# Altium schematic sheet EDTENS.SchDoc
size A0
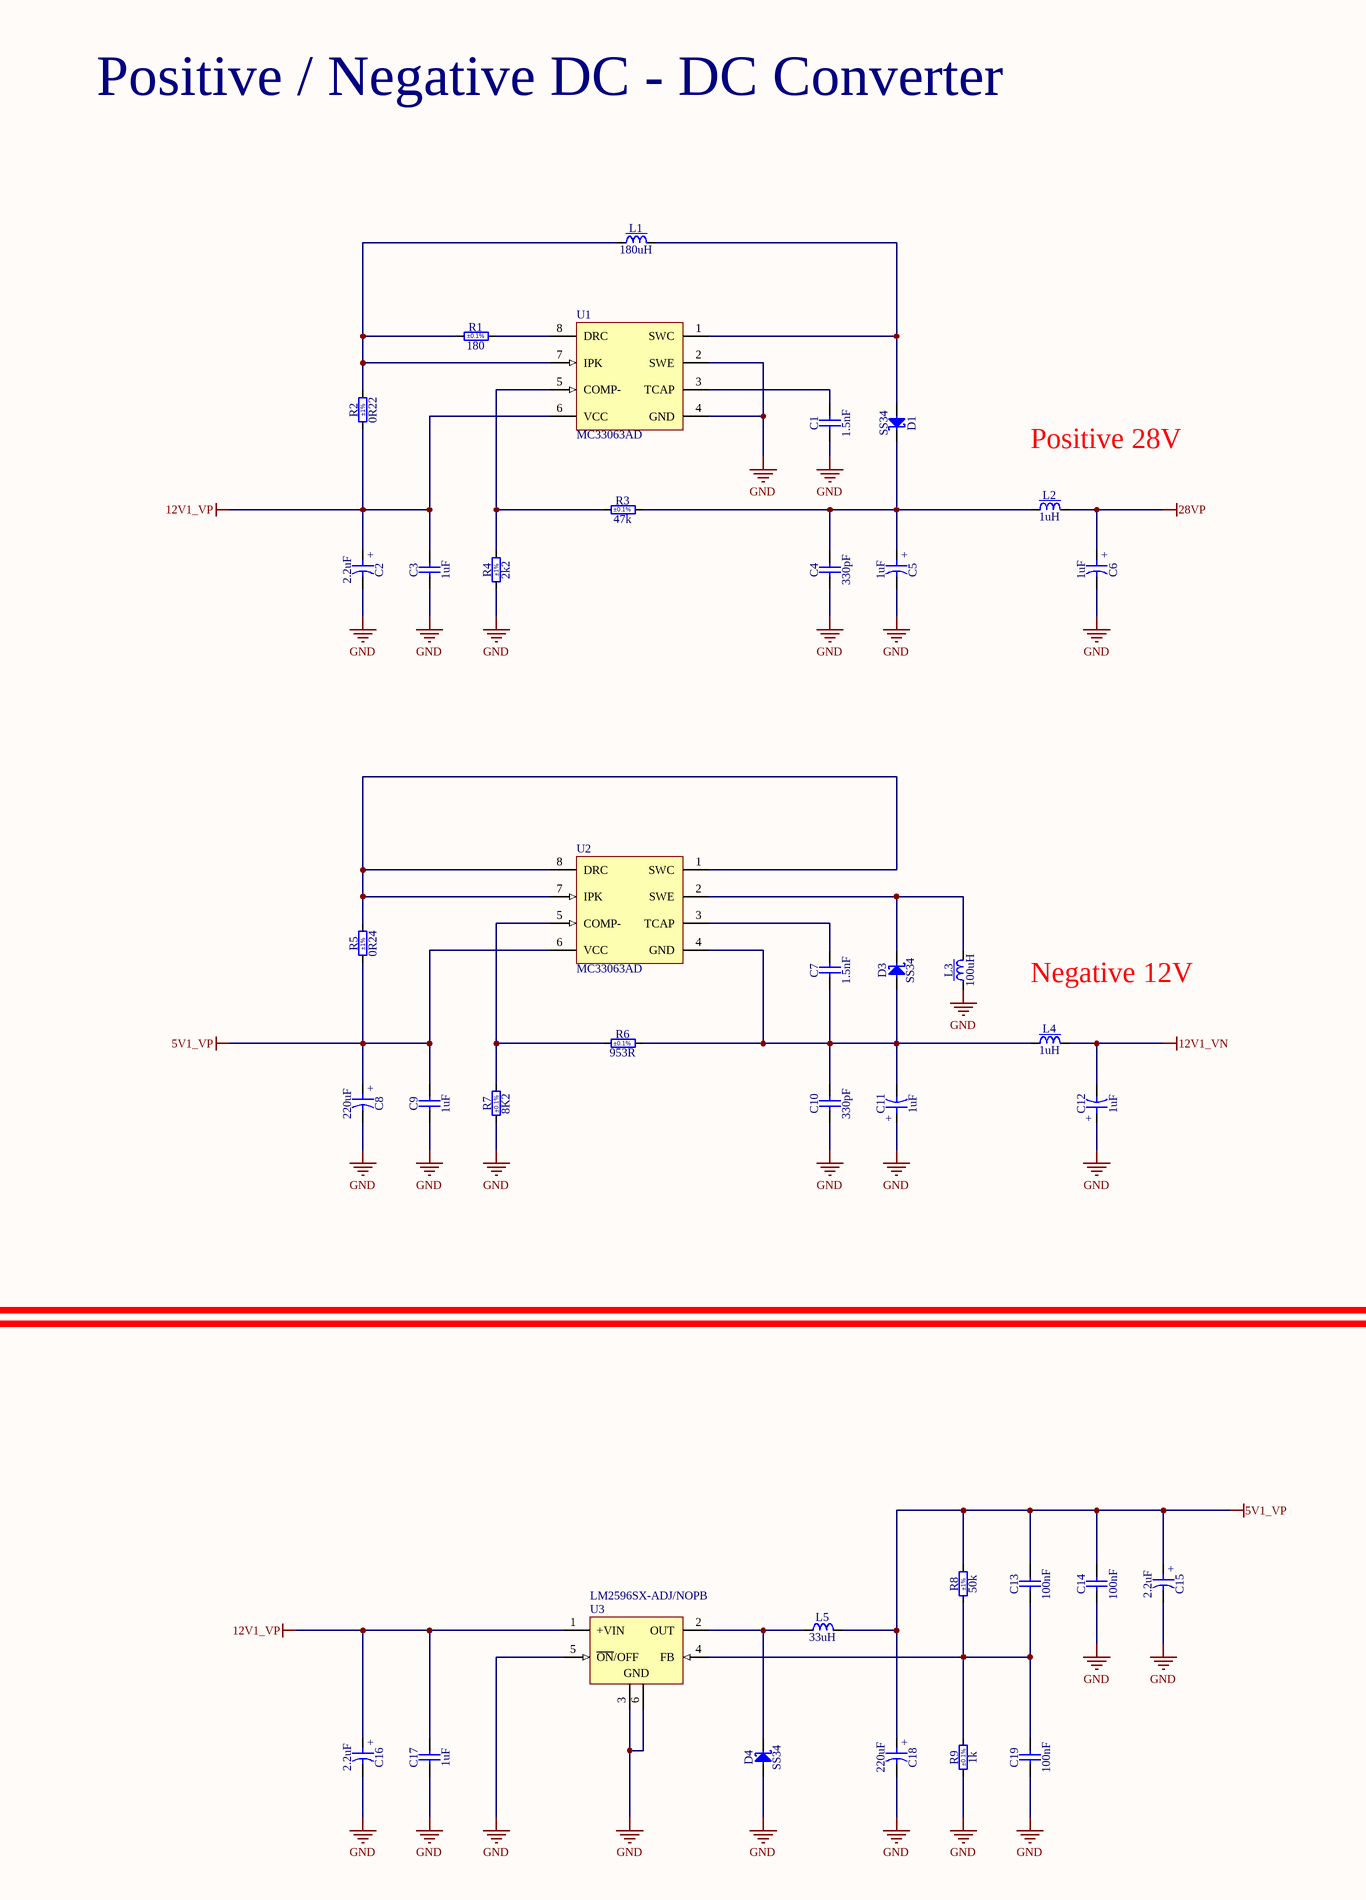
[diagram p0: EDTENS.SchDoc, left]
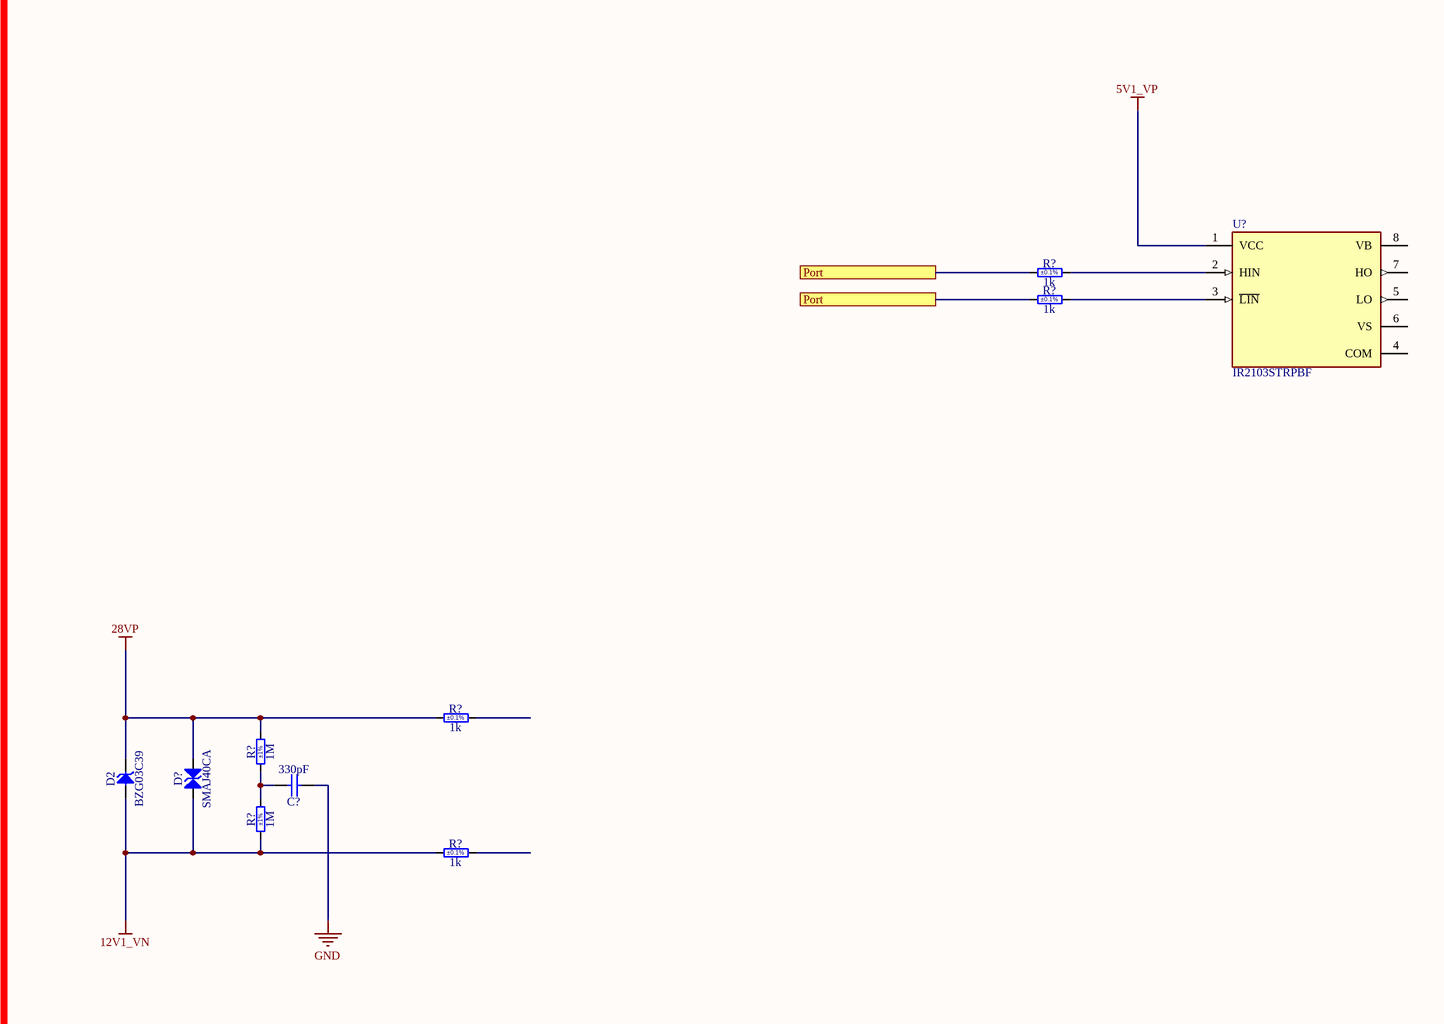
[diagram p1: EDTENS.SchDoc, right]

## Parts
(Parts that share a designator on the sheet are numbered #1, #2 ... from top to bottom, then left to right.)
C1  1.5nF  [CAPC3216X140N]
C2  2.2uF  [CAPMP3216X180N]
C3  1uF  [CAPC3216X140N]
C4  330pF  [CAPC3216X140N]
C5  1uF  [CAPMP6032X280N]
C6  1uF  [CAPMP3216X180N]
C7  1.5nF  [CAPC3216X140N]
C8  220uF  [CAPMP7343X430N]
C9  1uF  [CAPC3216X140N]
C10  330pF  [CAPC3216X140N]
C11  1uF  [CAPMP6032X280N]
C12  1uF  [CAPMP3216X180N]
C13  100nF  [CAPC3216X180N]
C14  100nF  [CAPC3216X180N]
C15  2.2uF  [CAPMP3216X180N]
C16  2.2uF  [CAPMP3216X180N]
C17  1uF  [CAPC3216X140N]
C18  220uF  [CAPMP7362X380N]
C19  100nF  [CAPC3216X180N]
C?  330pF  [CAPC3216X140N]
D1  SS34  [DIOM7959X265N]
D2  BZG03C39  [DIOM5326X230N]
D3  SS34  [DIOM7959X265N]
D4  SS34  [DIOM7959X265N]
D?  SMAJ40CA  [DIOM5226X262N]
L1  180uH  [IND_WURTH_WE-PD_XXL]
L2  1uH  [INDM3225X210N]
L3  100uH  [IND_WURTH_WE-PD_XXL]
L4  1uH  [INDM3225X210N]
L5  33uH  [IND_BOURNS_PM127SH]
R1  180  Tolerance: ±0.1%  [RESC3216X65N]
R2  0R22  Tolerance: ±1%  [RESC6532X80N]
R3  47k  Tolerance: ±0.1%  [RESC3216X65N]
R4  2k2  Tolerance: ±1%  [RESC3216X65N]
R5  0R24  Tolerance: ±1%  [RESC6532X80N]
R6  953R  Tolerance: ±0.1%  [RESC3216X65N]
R7  8K2  Tolerance: ±0.1%  [RESC3216X65N]
R8  50k  Tolerance: ±1%  [RES_SEI_HVC1206]
R9  1k  Tolerance: ±0.1%  [RESC3216X65N]
R?#1  1k  Tolerance: ±0.1%  [RESC3216X65N]
R?#2  1k  Tolerance: ±0.1%  [RESC3216X65N]
R?#3  1k  Tolerance: ±0.1%  [RESC3216X65N]
R?#4  1M  Tolerance: ±1%  [RESC6331X70N]
R?#5  1M  Tolerance: ±1%  [RESC6331X70N]
R?#6  1k  Tolerance: ±0.1%  [RESC3216X65N]
U1  MC33063AD  [D0008A_N]
U2  MC33063AD  [D0008A_N]
U3  LM2596SX-ADJ/NOPB  [KTT0005B_L]
U?  IR2103STRPBF  [FP-PG-DSO-8-MFG]

## Blocks framed on the sheet
Positive / Negative DC - DC Converter: C1-C12 D1 D3 L1-L4 R1-R7 U1 U2

## Ports
Port

## Nets
5V1_VP: C8.1 C9.2 C13.2 C14.2 C15.1 C18.1 L5.2 R5.1 R8.2 U2.6(VCC) U?.1(VCC)
12V1_VN: C12.2 D2.2(A) D?.1 L4.2 R?#5.1 R?#6.1
12V1_VP: C2.1 C3.2 C16.1 C17.2 R2.1 U1.6(VCC) U3.1(+VIN)
28VP: C6.1 D2.1(C) D?.2 L2.2 R?#3.1 R?#4.2
GND: C1.1 C2.2 C3.1 C4.1 C5.2 C6.2 C8.2 C9.1 C10.1 C11.1 C12.1 C14.1 C15.2 C16.2 C17.1 C18.2 C19.1 C?.1 D4.2(A) L3.1 R4.1 R7.1 R9.1 U1.2(SWE) U1.4(GND) U3.3(GND) U3.5(~{ON}/OFF) U3.6(GND)
Port: R?#1.1 R?#2.1 ; port Port
NetC1_2: C1.2 U1.3(TCAP)
NetC4_2: C4.2 C5.1 D1.1(C) L2.1 R3.2
NetC7_1: C7.1 C10.2 C11.2 D3.2(A) L4.1 R6.2 U2.4(GND)
NetC7_2: C7.2 U2.3(TCAP)
NetC13_1: C13.1 C19.2 R8.1 R9.2 U3.4(FB)
NetC?_2: C?.2 R?#4.1 R?#5.2
NetD1_2: D1.2(A) L1.2 U1.1(SWC)
NetD3_1: D3.1(C) L3.2 U2.2(SWE)
NetD4_1: D4.1(C) L5.1 U3.2(OUT)
NetL1_1: L1.1 R1.1 R2.2 U1.7(IPK)
NetR1_2: R1.2 U1.8(DRC)
NetR3_1: R3.1 R4.2 U1.5(COMP-)
NetR5_2: R5.2 U2.1(SWC) U2.7(IPK) U2.8(DRC)
NetR6_1: R6.1 R7.2 U2.5(COMP-)
NetR?#1_2: R?#1.2 U?.2(HIN)
NetR?#2_2: R?#2.2 U?.3(~{LIN})

Not connected (* = marked no-connect by the designer): R?#3 2; R?#6 2; U? 4(COM) 5(LO) 6(VS) 7(HO) 8(VB)

## Notes on the sheet
- Positive 28V
- Negative 12V
- (in symbol CTE3216-18_1UF_35V_10%) +
- (in symbol CTE3216-18_2.2UF_25V_10%) +
- (in symbol CTE6032-28_1UF_50V_10%) +
- (in symbol CTE7343-43_220UF_16V_10%) +
- (in symbol CTE7362-38_220UF_16V_10%_LESR0075) +

## Library data of the parts
C1 C7 = CC1206_1.5NF_50V_5%_NP0: Non-polarised capacitor; Part Description: SMD Multilayer Chip Ceramic Capacitor; Manufacturer: GENERIC; Manufacturer1 Part Number: 2238 863 15152; Voltage: 50V; TC: C0G/NP0; Tolerance: ±5%; Part Number: CC1206_1.5NF_50V_5%_NP0; Component Kind: Standard; Component Type: Standard; Pin Count: 2; Value: 1.5nF; Status: Preferred; Manufacturer Part Number: CC1206_1.5NF_50V_5%_NP0; Case: 1206; Mounted: Yes; Socket: No; SMD: Yes; Sense: No; Manufacturer1 Example: PHYCOMP; Manufacturer1 ComponentHeight: 1.25mm; HelpURL: \\cern.ch\dfs\Applications\Altium\Datasheets\CC1206_NP0_PHYCOMP.pdf; Author: CERN DEM JLC; CreateDate: 12/3/2007; LatestRevisionDate: 12/3/2007
C2 C15 C16 = CTE3216-18_2.2UF_25V_10%: Polarised capacitor; Part Description: Solid Tantalum Chip Capacitor; Manufacturer: GENERIC; Manufacturer1 Part Number: TAJA225K025R; Voltage: 25V; Tolerance: ±10%; Part Number: CTE3216-18_2.2UF_25V_10%; Component Kind: Standard; Component Type: Standard; Pin Count: 2; Value: 2.2uF; Status: Preferred; Manufacturer Part Number: CTE3216-18_2.2UF_25V_10%; Case: A; Mounted: Yes; Socket: No; SMD: Yes; Sense: No; Manufacturer1 Example: AVX; Manufacturer1 ComponentHeight: 1.8mm; HelpURL: \\cern.ch\dfs\Applications\Altium\Datasheets\CTE_AVX_TAJ.pdf; Author: CERN DEM JLC; CreateDate: 5/26/2008; LatestRevisionDate: 5/26/2008
C3 C9 C17 = CC1206_1UF_100V_10%_X7R: Non-polarised capacitor; Part Description: SMD Multilayer Chip Ceramic Capacitor; Manufacturer: GENERIC; Manufacturer1 Part Number: C1206C105K1RAC; Voltage: 100V; TC: X7R; Tolerance: ±10%; Part Number: CC1206_1UF_100V_10%_X7R; Component Kind: Standard; Component Type: Standard; Pin Count: 2; Value: 1uF; Status: Preferred; Manufacturer Part Number: CC1206_1UF_100V_10%_X7R; Case: 1206; Mounted: Yes; Socket: No; SMD: Yes; Sense: No; Manufacturer1 Example: KEMET; Manufacturer1 ComponentHeight: 1.8mm; HelpURL: \\cern.ch\dfs\Applications\Altium\Datasheets\CC1206_X7R_KEMET_OPENMODE.pdf; Author: CERN DEM BC; CreateDate: 1/24/2020; LatestRevisionDate: 1/24/2020
C4 C10 C? = CC1206_330PF_100V_10%_NP0: Non-polarised capacitor; Part Description: SMD Multilayer Chip Ceramic Capacitor; Manufacturer: GENERIC; Manufacturer1 Part Number: 12061A331KAT2A; Voltage: 100V; TC: C0G/NP0; Tolerance: ±10%; Part Number: CC1206_330PF_100V_10%_NP0; Component Kind: Standard; Component Type: Standard; Pin Count: 2; Value: 330pF; Status: Preferred; Manufacturer Part Number: CC1206_330PF_100V_10%_NP0; Case: 1206; Mounted: Yes; Socket: No; SMD: Yes; Sense: No; Manufacturer1 Example: AVX; Manufacturer1 ComponentHeight: 0.94mm; HelpURL: \\cern.ch\dfs\Applications\Altium\Datasheets\CC1206_NP0_AVX.pdf; Author: CERN DEM JLC; CreateDate: 8/24/2009; LatestRevisionDate: 8/24/2009
C5 C11 = CTE6032-28_1UF_50V_10%: Polarised capacitor; Part Description: Solid Tantalum Chip Capacitor; Manufacturer: GENERIC; Manufacturer1 Part Number: TAJC105K050R; Voltage: 50V; Tolerance: ±10%; Part Number: CTE6032-28_1UF_50V_10%; Component Kind: Standard; Component Type: Standard; Pin Count: 2; Value: 1uF; Status: Preferred; Manufacturer Part Number: CTE6032-28_1UF_50V_10%; Case: C; Mounted: Yes; Socket: No; SMD: Yes; Sense: No; Manufacturer1 Example: AVX; Manufacturer1 ComponentHeight: 2.8mm; HelpURL: \\cern.ch\dfs\Applications\Altium\Datasheets\CTE_AVX_TAJ.pdf; Author: CERN DEM JLC; CreateDate: 12/3/2007; LatestRevisionDate: 12/3/2007
C6 C12 = CTE3216-18_1UF_35V_10%: Polarised capacitor; Part Description: Solid Tantalum Chip Capacitor; Manufacturer: GENERIC; Manufacturer1 Part Number: TAJA105K035R; Voltage: 35V; Tolerance: ±10%; Part Number: CTE3216-18_1UF_35V_10%; Component Kind: Standard; Component Type: Standard; Pin Count: 2; Value: 1uF; Status: Preferred; Manufacturer Part Number: CTE3216-18_1UF_35V_10%; Case: A; Mounted: Yes; Socket: No; SMD: Yes; Sense: No; Manufacturer1 Example: AVX; Manufacturer1 ComponentHeight: 1.8mm; HelpURL: \\cern.ch\dfs\Applications\Altium\Datasheets\CTE_AVX_TAJ.pdf; Author: CERN DEM JLC; CreateDate: 12/3/2007; LatestRevisionDate: 12/3/2007
C8 = CTE7343-43_220UF_16V_10%: Polarised capacitor; Part Description: Solid Tantalum Chip Capacitor; Manufacturer: GENERIC; Manufacturer1 Part Number: TAJE227K016R; Voltage: 16V; Tolerance: ±10%; Part Number: CTE7343-43_220UF_16V_10%; Component Kind: Standard; Component Type: Standard; Pin Count: 2; Value: 220uF; Status: Preferred; Manufacturer Part Number: CTE7343-43_220UF_16V_10%; Case: E; Mounted: Yes; Socket: No; SMD: Yes; Sense: No; Manufacturer1 Example: AVX; Manufacturer1 ComponentHeight: 4.3mm; HelpURL: \\cern.ch\dfs\Applications\Altium\Datasheets\CTE_AVX_TAJ.pdf; Author: CERN DEM JLC; CreateDate: 12/3/2007; LatestRevisionDate: 12/3/2007
C13 C14 C19 = CC1206_100NF_50V_5%_C0G_TDK_CGA5L2C0G1H104J160AA: Non-polarised capacitor; Part Description: SMD Multilayer Chip Ceramic Capacitor (Automotive Grade); Manufacturer: TDK; Voltage: 50V; TC: C0G/NP0; Tolerance: ±5%; Part Number: CC1206_100NF_50V_5%_C0G_TDK_CGA5L2C0G1H104J160AA; Component Kind: Standard; Component Type: Standard; Pin Count: 2; Value: 100nF; Status: Not Recommended; Manufacturer Part Number: CGA5L2C0G1H104J160AA; Case: 1206; Mounted: Yes; Socket: No; SMD: Yes; Sense: No; ComponentHeight: 1.8mm; HelpURL: \\cern.ch\dfs\Applications\Altium\Datasheets\CC1206_C0G_TDK_CGA(up to 50V).pdf; Author: CERN DEM BC; CreateDate: 4/18/2016; LatestRevisionDate: 1/24/2018
C18 = CTE7362-38_220UF_16V_10%_LESR0075: Polarised capacitor; Part Description: Low ESR 0R075 Solid Tantalum Chip Capacitor; Manufacturer: GENERIC; Manufacturer1 Part Number: TPSV227K016R0075; Voltage: 16V; Tolerance: ±10%; Part Number: CTE7362-38_220UF_16V_10%_LESR0075; Component Kind: Standard; Component Type: Standard; Pin Count: 2; Value: 220uF; Status: Preferred; Manufacturer Part Number: CTE7362-38_220UF_16V_10%_LESR0075; Case: V; Mounted: Yes; Socket: No; SMD: Yes; Sense: No; Manufacturer1 Example: AVX; Manufacturer1 ComponentHeight: 3.8mm; HelpURL: \\cern.ch\dfs\Applications\Altium\Datasheets\CTE-LESR_AVX_TPS.pdf; Author: CERN DEM JLC; CreateDate: 5/5/2008; LatestRevisionDate: 7/6/2009
D1 D3 D4 = SS34: Schottky Diode; Part Description: Surface Mount Schottky Barrier Rectifier; Manufacturer: FAIRCHILD SEMICONDUCTOR; Voltage: 40V; Power: 3A; PressFit: No; Bonding: No; Part Number: SS34; Component Kind: Standard; Component Type: Standard; Device: SS34; PackageDescription: DO-214-AB/SMC Molded Diode, Body 7.95x5.9mm, IPC Medium Density; Manufacturer Part Number: SS34; Pin Count: 2; Case: DO-214AB; Mounted: Yes; Socket: No; SMD: Yes; Sense: No; ComponentHeight: 2.65mm; HelpURL: \\cern.ch\dfs\Applications\Altium\Datasheets\SS34.pdf; Author: CERN DEM JLC; CreateDate: 8/23/2010; LatestRevisionDate: 11/8/2017
D2 = BZG03C39: Zener Diode; Part Description: Voltage Regulator Diode; Manufacturer: VISHAY SEMICONDUCTORS; Voltage: 39V; Power: 1.25W; PressFit: No; Bonding: No; Part Number: BZG03C39; Component Kind: Standard; Component Type: Standard; Device: BZG03C39; PackageDescription: DO-214-AC/SMA Molded Diode, Body 5.3x2.6mm, IPC Medium Density; Manufacturer Part Number: BZG03C39; Pin Count: 2; Case: DO-214AC; Mounted: Yes; Socket: No; SMD: Yes; Sense: No; ComponentHeight: 2.3mm; HelpURL: \\cern.ch\dfs\Applications\Altium\Datasheets\BZG03C.pdf; Author: CERN DEM JLC; CreateDate: 6/2/2008; LatestRevisionDate: 6/2/2008
D? = SMAJ40CA: Transient Voltage Suppressor Diode (Bi-Directional); Part Description: Surface Mount Bi-directional Transient Voltage Suppressor Diode; Manufacturer: BOURNS; Voltage: 40V; Power: 400W; PressFit: No; Bonding: No; Part Number: SMAJ40CA; Component Kind: Standard; Component Type: Standard; Device: SMAJ40CA; PackageDescription: DO-214-AC/SMA Diode, Molded Body; 5.21mm L X 2.605mm W X 2.62mm H, IPC Medium Density; Manufacturer Part Number: SMAJ40CA; Pin Count: 2; Case: DO-214AC; Mounted: Yes; Socket: No; SMD: Yes; Sense: No; ComponentHeight: 2.62mm; HelpURL: \\cern.ch\dfs\Applications\Altium\Datasheets\SMAJ40CA.pdf; Author: CERN DEM JLC; CreateDate: 7/11/2018; LatestRevisionDate: 7/11/2018
L1 = IND_100UH_20%_WURTH_WE-PD_7447709101: Inductor With Core; Part Number: IND_180UH_20%_WURTH_WE-PD_7447709101; Part Description: Power-Choke Inductor (WE-PD Series); Manufacturer: WURTH ELEKTRONIK; Power: 2.5A; Resistance: 0.1R; Tolerance: ±20%; Component Kind: Standard; Component Type: Standard; Pin Count: 2; Value: 180uH; Manufacturer Part Number: 7447709101; Mounted: Yes; Socket: No; SMD: Yes; Sense: No; ComponentHeight: 10mm; HelpURL: \\cern.ch\dfs\Applications\Altium\Datasheets\IND_WURTH_WE-PD_7447709101.pdf; Author: Mehdi Amiri; CreateDate: 3/15/2012; LatestRevisionDate: 11/04/2023
L2 L4 = IND1210_1UH_10%_EPCOS_B82422A: Inductor With Core; Part Description: SMT Inductor SIMID Series; Manufacturer: EPCOS; Manufacturer Part Number: B82422A1102K100; Power: 380mA; Resistance: 0.34R; Tolerance: ±10%; Part Number: IND1210_1UH_10%_EPCOS_B82422A; Component Kind: Standard; Component Type: Standard; Pin Count: 2; Value: 1uH; Case: 1210; Mounted: Yes; Socket: No; SMD: Yes; Sense: No; ComponentHeight: 2.1mm; HelpURL: \\cern.ch\dfs\Applications\Altium\Datasheets\IND1210_EPCOS_B82422A.pdf; Author: CERN DEM JLC; CreateDate: 11/30/2011; LatestRevisionDate: 11/30/2011
L3 = IND_100UH_20%_WURTH_WE-PD_7447709101: Inductor With Core; Part Description: Power-Choke Inductor (WE-PD Series); Manufacturer: WURTH ELEKTRONIK; Power: 2.5A; Resistance: 0.1R; Tolerance: ±20%; Part Number: IND_100UH_20%_WURTH_WE-PD_7447709101; Component Kind: Standard; Component Type: Standard; Pin Count: 2; Value: 100uH; Manufacturer Part Number: 7447709101; Mounted: Yes; Socket: No; SMD: Yes; Sense: No; ComponentHeight: 10mm; HelpURL: \\cern.ch\dfs\Applications\Altium\Datasheets\IND_WURTH_WE-PD_7447709101.pdf; Author: CERN DEM JLC; CreateDate: 3/15/2012; LatestRevisionDate: 3/15/2012
L5 = IND_33UH_20%_BOURNS_PM127SH: Inductor; Part Description: Shielded SMD Power Inductor PM127SH Series; Manufacturer: BOURNS; Manufacturer Part Number: PM127SH-330M-RC; Power: 3.5A; Resistance: 0.057R; Tolerance: ±20%; Part Number: IND_33UH_20%_BOURNS_PM127SH; Component Kind: Standard; Component Type: Standard; Pin Count: 2; Value: 33uH; Mounted: Yes; Socket: No; SMD: Yes; Sense: No; ComponentHeight: 8mm; HelpURL: \\cern.ch\dfs\Applications\Altium\Datasheets\IND_BOURNS_PM127SH.pdf; Author: CERN DEM JLC; CreateDate: 11/18/2009; LatestRevisionDate: 11/18/2009
R1 = R1206_180R_0.1%_0.25W_25PPM: Resistor - 0.1%; Part Description: Thin Film Chip Resistor; Manufacturer: GENERIC; Manufacturer1 Part Number: RN73H2BTTD1800B25; Power: 0.25W; TC: ±25ppm/°C; PressFit: No; Part Number: R1206_180R_0.1%_0.25W_25PPM; Component Kind: Standard; Component Type: Standard; Pin Count: 2; Value: 180; Status: Not Recommended; Manufacturer Part Number: R1206_180R_0.1%_0.25W_25PPM; Case: 1206; Mounted: Yes; Sense: No; Socket: No; SMD: Yes; Manufacturer1 Example: KOA; Manufacturer1 ComponentHeight: 0.70mm; HelpURL: \\cern.ch\dfs\Applications\Altium\Datasheets\R1206_KOA_RN73H.pdf; Author: CERN DEM JLC; CreateDate: 12/3/2007; LatestRevisionDate: 3/13/2008
R2 = R2512_0R5_1%_1.5W_100PPM: Resistor - 1%; Part Number: R2512_0R22_1%_1.5W_100PPM; Part Description: Thick Film Chip Resistor; Manufacturer: GENERIC; Manufacturer1 Part Number: LR2512-R22FW; Power: 1.5W; TC: ±100ppm/°C; PressFit: No; Component Kind: Standard; Component Type: Standard; Pin Count: 2; Value: 0R22; Status: None; Manufacturer Part Number: R2512_0R22_1%_1.5W_100PPM; Case: 2512; Mounted: Yes; Sense: No; Socket: No; SMD: Yes; Manufacturer1 Example: WELWYN; Manufacturer1 ComponentHeight: 0.8mm; HelpURL: \\cern.ch\dfs\Applications\Altium\Datasheets\R2512_WELWYN_LR.pdf; Author: Mehdi Amiri; CreateDate: 8/23/2010; LatestRevisionDate: 8/23/2010
R3 = R1206_47K_0.1%_0.25W_25PPM: Resistor - 0.1%; Part Description: Thin Film Chip Resistor; Manufacturer: GENERIC; Manufacturer1 Part Number: RN73H2BTTD4702B25; Power: 0.25W; TC: ±25ppm/°C; PressFit: No; Part Number: R1206_47K_0.1%_0.25W_25PPM; Component Kind: Standard; Component Type: Standard; Pin Count: 2; Value: 47k; Status: Not Recommended; Manufacturer Part Number: R1206_47K_0.1%_0.25W_25PPM; Case: 1206; Mounted: Yes; Sense: No; Socket: No; SMD: Yes; Manufacturer1 Example: KOA; Manufacturer1 ComponentHeight: 0.70mm; HelpURL: \\cern.ch\dfs\Applications\Altium\Datasheets\R1206_KOA_RN73H.pdf; Author: CERN DEM JLC; CreateDate: 12/3/2007; LatestRevisionDate: 3/13/2008
R4 = R1206_2K2_1%_0.25W_100PPM: Resistor - 1%; Part Description: General Purpose Thick Film Chip Resistor; Manufacturer: GENERIC; Manufacturer1 Part Number: NRC12F2201TRF; Power: 0.25W; TC: ±100ppm/°C; PressFit: No; Part Number: R1206_2K2_1%_0.25W_100PPM; Component Kind: Standard; Component Type: Standard; Pin Count: 2; Value: 2k2; Status: Preferred; Manufacturer Part Number: R1206_2K2_1%_0.25W_100PPM; Case: 1206; Mounted: Yes; Sense: No; Socket: No; SMD: Yes; Manufacturer1 Example: NIC COMPONENT; Manufacturer1 ComponentHeight: 0.65mm; HelpURL: \\cern.ch\dfs\Applications\Altium\Datasheets\R1206_NIC_NRC.pdf; Author: CERN DEM JLC; CreateDate: 12/3/2007; LatestRevisionDate: 3/13/2008
R5 = R2512_0R5_1%_1.5W_100PPM: Resistor - 1%; Part Number: R2512_0R24_1%_1.5W_100PPM; Part Description: Thick Film Chip Resistor; Manufacturer: GENERIC; Manufacturer1 Part Number: LR2512-R24FW; Power: 1.5W; TC: ±100ppm/°C; PressFit: No; Component Kind: Standard; Component Type: Standard; Pin Count: 2; Value: 0R24; Status: None; Manufacturer Part Number: R2512_0R24_1%_1.5W_100PPM; Case: 2512; Mounted: Yes; Sense: No; Socket: No; SMD: Yes; Manufacturer1 Example: WELWYN; Manufacturer1 ComponentHeight: 0.8mm; HelpURL: \\cern.ch\dfs\Applications\Altium\Datasheets\R2512_WELWYN_LR.pdf; Author: Mehdi Amiri; CreateDate: 8/23/2010; LatestRevisionDate: 8/23/2010
R6 = R1206_1K_0.1%_0.25W_25PPM: Resistor - 0.1%; Part Number: R1206_953R_0.1%_0.25W_25PPM; Part Description: Thin Film Chip Resistor; Manufacturer: GENERIC; Manufacturer1 Part Number: RN73H2BTTD953B25; Power: 0.25W; TC: ±25ppm/°C; PressFit: No; Component Kind: Standard; Component Type: Standard; Pin Count: 2; Value: 953R; Status: Not Recommended; Manufacturer Part Number: R1206_953R_0.1%_0.25W_25PPM; Case: 1206; Mounted: Yes; Sense: No; Socket: No; SMD: Yes; Manufacturer1 Example: KOA; Manufacturer1 ComponentHeight: 0.70mm; HelpURL: \\cern.ch\dfs\Applications\Altium\Datasheets\R1206_KOA_RN73H.pdf; Author: Mehdi Amiri; CreateDate: 12/3/2007; LatestRevisionDate: 11/1/2011
R7 = R1206_8K2_0.1%_0.25W_25PPM: Resistor - 0.1%; Part Description: Thin Film Chip Resistor; Manufacturer: GENERIC; Manufacturer1 Part Number: RN73H2BTTD8201B25; Power: 0.25W; TC: ±25ppm/°C; PressFit: No; Part Number: R1206_8K2_0.1%_0.25W_25PPM; Component Kind: Standard; Component Type: Standard; Pin Count: 2; Value: 8k2; Status: Not Recommended; Manufacturer Part Number: R1206_8K2_0.1%_0.25W_25PPM; Case: 1206; Mounted: Yes; Sense: No; Socket: No; SMD: Yes; Manufacturer1 Example: KOA; Manufacturer1 ComponentHeight: 0.70mm; HelpURL: \\cern.ch\dfs\Applications\Altium\Datasheets\R1206_KOA_RN73H.pdf; Author: CERN DEM JLC; CreateDate: 12/3/2007; LatestRevisionDate: 3/13/2008
R8 = R1206_50K_1%_0.33W_100PPM_SEI_HVC: Resistor - 0.1%; Part Description: High Voltage Thick Film Chip Resistor; Manufacturer: SEI (STACKPOLE ELECTRONICS INC.); Manufacturer Part Number: HVCB1206FDD50K0; Power: 0.33W; TC: ±100ppm/°C; Voltage: 1500V; PressFit: No; Part Number: R1206_50K_1%_0.33W_100PPM_SEI_HVC; Component Kind: Standard; Component Type: Standard; Pin Count: 2; Value: 50k; Status: None; Case: 1206; Mounted: Yes; Sense: No; Socket: No; SMD: Yes; ComponentHeight: 0.76mm; HelpURL: \\cern.ch\dfs\Applications\Altium\Datasheets\R1206_SEI_HVC.pdf; Author: CERN DEM JLC; CreateDate: 1/18/2018; LatestRevisionDate: 1/18/2018
R9 R?#1-R?#3 R?#6 = R1206_1K_0.1%_0.25W_25PPM: Resistor - 0.1%; Part Description: Thin Film Chip Resistor; Manufacturer: GENERIC; Manufacturer1 Part Number: RN73H2BTTD1001B25; Power: 0.25W; TC: ±25ppm/°C; PressFit: No; Part Number: R1206_1K_0.1%_0.25W_25PPM; Component Kind: Standard; Component Type: Standard; Pin Count: 2; Value: 1k; Status: Not Recommended; Manufacturer Part Number: R1206_1K_0.1%_0.25W_25PPM; Case: 1206; Mounted: Yes; Sense: No; Socket: No; SMD: Yes; Manufacturer1 Example: KOA; Manufacturer1 ComponentHeight: 0.70mm; HelpURL: \\cern.ch\dfs\Applications\Altium\Datasheets\R1206_KOA_RN73H.pdf; Author: CERN DEM JLC; CreateDate: 12/3/2007; LatestRevisionDate: 11/1/2011
R?#4 R?#5 = R2512_1M_1%_1W_100PPM: Resistor - 1%; Part Description: Thick Film Chip Resistor; Manufacturer: GENERIC; Manufacturer1 Part Number: 232276361005L or RC2512FK-071ML; Power: 1W; TC: ±100ppm/°C; PressFit: No; Part Number: R2512_1M_1%_1W_100PPM; Component Kind: Standard; Component Type: Standard; Pin Count: 2; Value: 1M; Status: Preferred; Manufacturer Part Number: R2512_1M_1%_1W_100PPM; Case: 2512; Mounted: Yes; Sense: No; Socket: No; SMD: Yes; Manufacturer1 Example: YAGEO PHYCOMP; Manufacturer1 ComponentHeight: 0.65mm; HelpURL: \\cern.ch\dfs\Applications\Altium\Datasheets\R2512_Phycomp_RC2512.pdf; Author: CERN DEM JLC; CreateDate: 7/21/2008; LatestRevisionDate: 10/17/2012
U1 U2 = CMP-0323-00189-3: Inverting Buck-Boost Regulator with 3 to 40 V Input and 1.25 to 40 V Output, -40 to 85 degC, 8-Pin SOIC (D), Green (RoHS & no Sb/Br); Manufacturer: Texas Instruments; Vout(Min)(V): 1.25; Vout(Max)(V): 40; Regulated Outputs(#): 1; Vin(Min)(V): 3; Iout(Max)(A): 0.75; Rating: Catalog; SubFamily: Step-Down Regulator; Switch Current Limit(Typ)(A): 1.5; Code_JEDEC: MS-012AA; Mounting Technology: Surface Mount; PackageVersion: revM, Jun-2011; ComponentLink3Description: URL Link1; Topology: Inverting Buck-Boost; Eco-Plan: Green (RoHS & no Sb/Br); ComponentLink3URL: Samples URL:http://www.ti.com/product/mc33063a#samples; DatasheetVersion: SLLS636M; PackageReference: D0008A; ComponentLink2Description: Package Specification; Vin(Max)(V): 40; ComponentLink1URL: http://www.ti.com/general/docs/lit/getliterature.tsp?genericPartNumber=MC33063A&fileType=pdf; PackageDescription: 8-Pin Plastic Small Outline Integrated Circuit, 4.9 x 3.9 mm, Pitch 1.27 mm Pitch; ComponentLink2URL: http://www.ti.com/litv/pdf/msoi002j; ComponentLink1Description: Datasheet; PartNumber: MC33063AD
U3 = CMP-2000-06545-1: Simple Switcher(R) Power Converter 150 kHz Step-Down Voltage Regulator, 3 A, 4.5 to 40 V, -40 to 125 degC, 5-Pin TO-263 (KTT), Green (RoHS & no Sb/Br), Tape and Reel; PartNumber: LM2596; Manufacturer: Texas Instruments; Package Version: 4200577-4/G, 01/2013; Primary Input Voltage: 40V; No. of Outputs: 1; No. of Pins: 5; SVHC: NoSVHC(19-Dec-2012); Output Voltage: 37V; Output Current: 3A; Datasheet Version: Rev. C, 04/2013; Package Reference: KTT5; MSL: MSL3-168hours; Number of Outputs: 1; Operating Temperature Min: -40°C; Operating Temperature Range: -40°Cto+125°C; Manufacturer URL: http://www.ti.com/; Package URL: http://www.ti.com/litv/pdf/mpsf007e; Voltage Regulator Case Style: TO-263; Operating Temperature Max: 125°C; Package Description: 5-Pin Plastic Flange Mount, Body 10.16 x 8.925 mm, Pitch 1.7 mm; Datasheet URL: http://www.ti.com/lit/ds/symlink/lm2596.pdf; Mounting Technology: SurfaceMount
U? = CMP-32851-000120-1: IC GATE DRVR HALF-BRIDGE 8SOIC; Number of Drivers: 2; Propagation Delay: 680ns; Output Current: 360mA; Fall Time: 60ns; Channel Type: Independent; RoHS Compliant: Yes; Mount: Surface Mount; Number of Channels: 2; Package Quantity: 1; Max Operating Temperature: 150°C; Number of Pins: 8; Width: 0.157inch; Number of Outputs: 2; Height: 0.059inch; Packaging: Cut Tape; Halogen Free: Not Halogen Free; Min Operating Temperature: -40°C; Lead Free: Lead Free; Max Output Current: 360mA; Length: 0.196inch; Series: -; Case/Package: SOIC